# Altium schematic sheet Sheet10.SchDoc
size A4
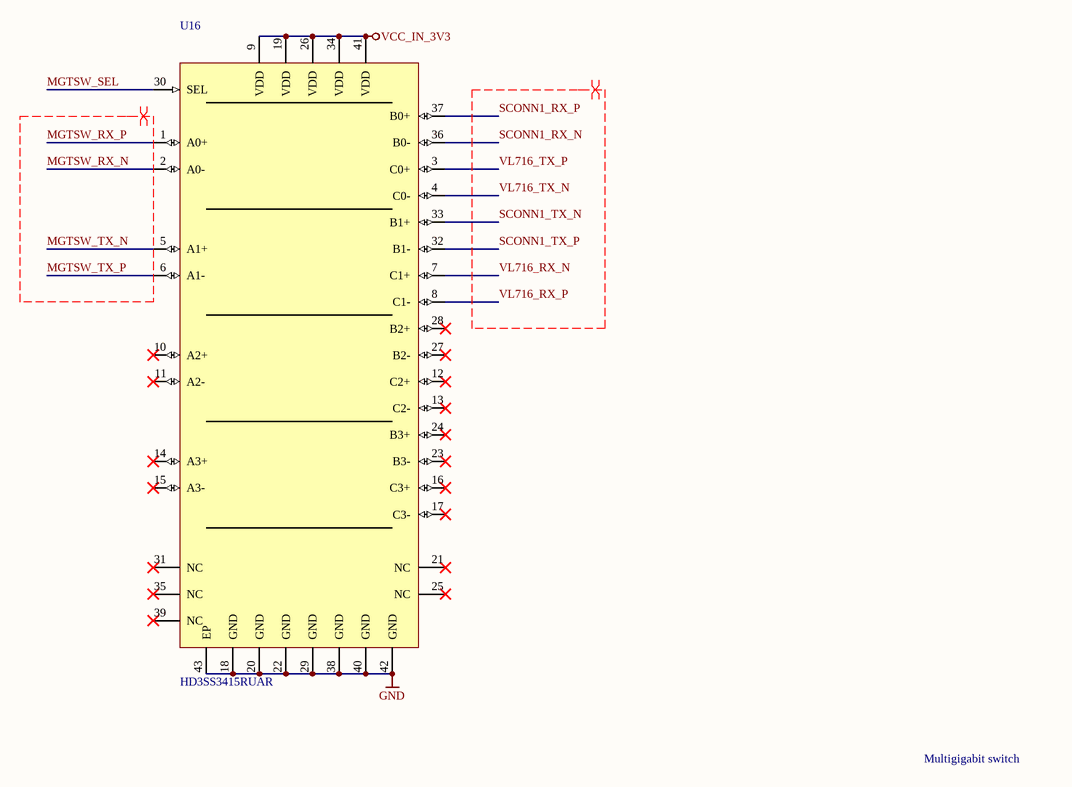
[diagram p0: Sheet10.SchDoc]

## Parts
U16  HD3SS3415RUAR  [HD3SS3415RUAR]

## Nets
GND: U16.18(GND) U16.20(GND) U16.22(GND) U16.29(GND) U16.38(GND) U16.40(GND) U16.42(GND) U16.43(EP)
VCC_IN_3V3: U16.9(VDD) U16.19(VDD) U16.26(VDD) U16.34(VDD) U16.41(VDD)
MGTSW_RX_N: U16.2(A0-)
MGTSW_RX_P: U16.1(A0+)
MGTSW_SEL: U16.30(SEL)
MGTSW_TX_N: U16.5(A1+)
MGTSW_TX_P: U16.6(A1-)
SCONN1_RX_N: U16.36(B0-)
SCONN1_RX_P: U16.37(B0+)
SCONN1_TX_N: U16.33(B1+)
SCONN1_TX_P: U16.32(B1-)
VL716_RX_N: U16.7(C1+)
VL716_RX_P: U16.8(C1-)
VL716_TX_N: U16.4(C0-)
VL716_TX_P: U16.3(C0+)

Not connected (* = marked no-connect by the designer): U16 10(A2+)* 11(A2-)* 12(C2+)* 13(C2-)* 14(A3+)* 15(A3-)* 16(C3+)* 17(C3-)* 21(NC)* 23(B3-)* 24(B3+)* 25(NC)* 27(B2-)* 28(B2+)* 31(NC)* 35(NC)* 39(NC)*

## Layout directives
differential pair: MGTSW_RX_N, MGTSW_RX_P, MGTSW_TX_N, MGTSW_TX_P, SCONN1_RX_N, SCONN1_RX_P, SCONN1_TX_N, SCONN1_TX_P, VL716_RX_N, VL716_RX_P, VL716_TX_N, VL716_TX_P

## Notes on the sheet
- Multigigabit switch

## Library data of the parts
U16 = HD3SS3415RUAR: 4-Channel High-Performance Differential Switch